# EAGLE design Arduino Nano RGB Led Controller (EAGLE 7.6.0)
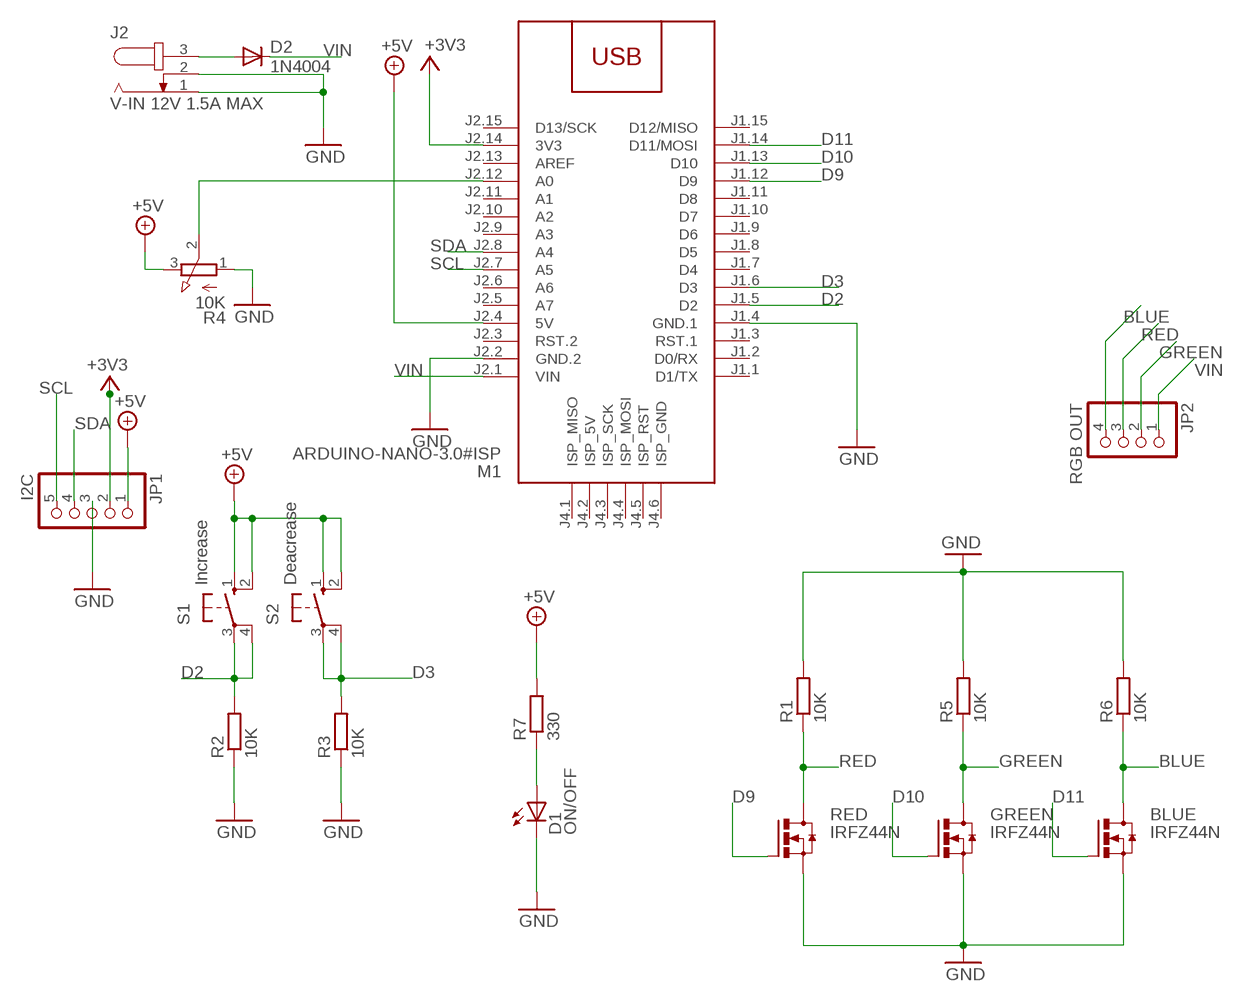
[diagram p0: schematic, sheet 1]

## Parts
BLUE  IRFZ44N  [TO220V]
D1  ON/OFF  LEDCHIPLED_1206  [CHIPLED_1206]
D2  1N4004  [DO41-10]
GREEN  IRFZ44N  [TO220V]
J2  V-IN 12V 1.5A MAX  JACK-PLUG1  [SPC4078]
JP1  I2C  PINHD-1X55X2MM  [1_05X2MM]
JP2  RGB OUT  PINHD-1X4  [1X04]
M1  ARDUINO-NANO-3.0#ISP  [ARDUINO-NANO-3.0#ISP]
R1  10K  R-EU_M1206  [M1206]
R2  10K  R-EU_M1206  [M1206]
R3  10K  R-EU_M1206  [M1206]
R4  10K  3RP/1610N  [3RP/1610N]
R5  10K  R-EU_M1206  [M1206]
R6  10K  R-EU_M1206  [M1206]
R7  330  R-EU_M1206  [M1206]
RED  IRFZ44N  [TO220V]
S1  Increase  10-XX  [B3F-10XX]
S2  Deacrease  10-XX  [B3F-10XX]

## Nets
+3V3: JP1.2 M1.J2.14(3V3)
+5V: JP1.1 M1.J2.4(5V) R4.3(E) R7.2 S1.1(S) S1.2(S1) S2.1(S) S2.2(S1)
BLUE [vin]: BLUE.2(D) JP2.4 R6.1
D2: M1.J1.5(D2) R2.2 S1.3(P) S1.4(P1)
D3: M1.J1.6(D3) R3.2 S2.3(P) S2.4(P1)
D9: M1.J1.12(D9) RED.1(G)
D10: GREEN.1(G) M1.J1.13(D10)
D11: BLUE.1(G) M1.J1.14(D11/MOSI)
GND: BLUE.3(S) D1.C GREEN.3(S) J2.1 J2.2 JP1.3 M1.J1.4(GND.1) M1.J2.2(GND.2) R1.2 R2.1 R3.1 R4.1(A) R5.2 R6.2 RED.3(S)
GREEN [vin]: GREEN.2(D) JP2.2 R5.1
N$1: M1.J2.12(A0) R4.2(S)
N$2: D1.A R7.1
N$3 [vin]: D2.A J2.3
RED [vin]: JP2.3 R1.1 RED.2(D)
SCL: JP1.5 M1.J2.7(A5)
SDA: JP1.4 M1.J2.8(A4)
VIN [vin]: D2.C JP2.1 M1.J2.1(VIN)
Unconnected: M1.J1.1(D1/TX) M1.J1.2(D0/RX) M1.J1.3(RST.1) M1.J1.7(D4) M1.J1.8(D5) M1.J1.9(D6) M1.J1.10(D7) M1.J1.11(D8) M1.J1.15(D12/MISO) M1.J2.3(RST.2) M1.J2.5(A7) M1.J2.6(A6) M1.J2.9(A3) M1.J2.10(A2) M1.J2.11(A1) M1.J2.13(AREF) M1.J2.15(D13/SCK) M1.J4.1(ISP_MISO) M1.J4.2(ISP_5V) M1.J4.3(ISP_SCK) M1.J4.4(ISP_MOSI) M1.J4.5(ISP_RST) M1.J4.6(ISP_GND)

## Library data of the parts
BLUE GREEN RED = MySemicontuctors:IRFZ44N
D1 = adafruit:LED: LED OSRAM: - CHIPLED LG R971, LG N971, LY N971, LG Q971, LY Q971, LO R971, LY R971 LH N974, LH R974 LS Q976, LO Q976, LY Q976 LO Q996 - Hyper CHIPLED LW Q18S LB Q993, LB Q99A, LB R99A - SideLED LS A670, LO A670, LY A670, LG A670, LP A670 LB A673, LV A673, LT A673, LW A673 LH A674 LY A675 LS A676, LA A676, LO A676, LY A676, LW A676 LS A679, LY A679, LG A679 - Hyper Micro SIDELED® LS Y876, LA Y876, LO Y876, LY Y876 LT Y87S - SmartLED LW L88C, LW L88S LB L89C, LB L89S, LG L890 LS L89K, LO L89K, LY L89K LS L896, LA L896, LO L896, LY L896 - TOPLED LS T670, LO T670, LY T670, LG T670, LP T670 LSG T670, LSP T670, LSY T670, LOP T670, LYG T670 LG T671, LOG T671, LSG T671 LB T673, LV T673, LT T673, LW T673 LH T674 LS T676, LA T676, LO T676, LY T676, LB T676, LH T676, LSB T676, LW T676 LB T67C, LV T67C, LT T67C, LS T67K, LO T67K, LY T67K, LW E67C LS E67B, LA E67B, LO E67B, LY E67B, LB E67C, LV E67C, LT E67C LW T67C LS T679, LY T679, LG T679 LS T770, LO T770, LY T770, LG T770, LP T770 LB T773, LV T773, LT T773, LW T773 LH T774 LS E675, LA E675, LY E675, LS T675 LS T776, LA T776, LO T776, LY T776, LB T776 LHGB T686 LT T68C, LB T68C - Hyper Mini TOPLED® LB M676 - Mini TOPLED Santana® LG M470 LS M47K, LO M47K, LY M47K Source: http://www.osram.convergy.de/
D2 = diode:1N4004: DIODE general purpose rectifier, 1 A
J2 = con-jack:JACK-PLUG: DC POWER JACK Power Jack, DC, Right Angle, Through Hole, Rated 5A at 16VDC, PC Terminals Distributor: Farnell (www.Farnell.de) Drawing: 84N1161.pdf / 84N1162.pdf Manufacturer: SPC Technology (www.spctechnology.com) Type: SPC4077 / SPC 4078; OC_FARNELL: unknown; OC_NEWARK: unknown
JP1 = pinhead:PINHD-1X5: PIN HEADER
JP2 = pinhead:PINHD-1X4: PIN HEADER
M1 = diy-modules:ARDUINO-NANO-3.0#ISP: Arduino Nano 3.0 with ISP pads
R1-R3 R5-R7 = rcl:R-EU_: RESISTOR, European symbol
R4 = pot:3RP/1610N: 16mm Potentiometer one level Source: http://www.alphapotentiometers.net/html/16mm_pot_2.html
S1 S2 = switch-omron:10-XX: OMRON SWITCH; MPN: B3F-1000; OC_FARNELL: 176432; OC_NEWARK: 36M3542

## Net classes
1 vin: width 0.762 mm, clearance 0.203 mm

## Board
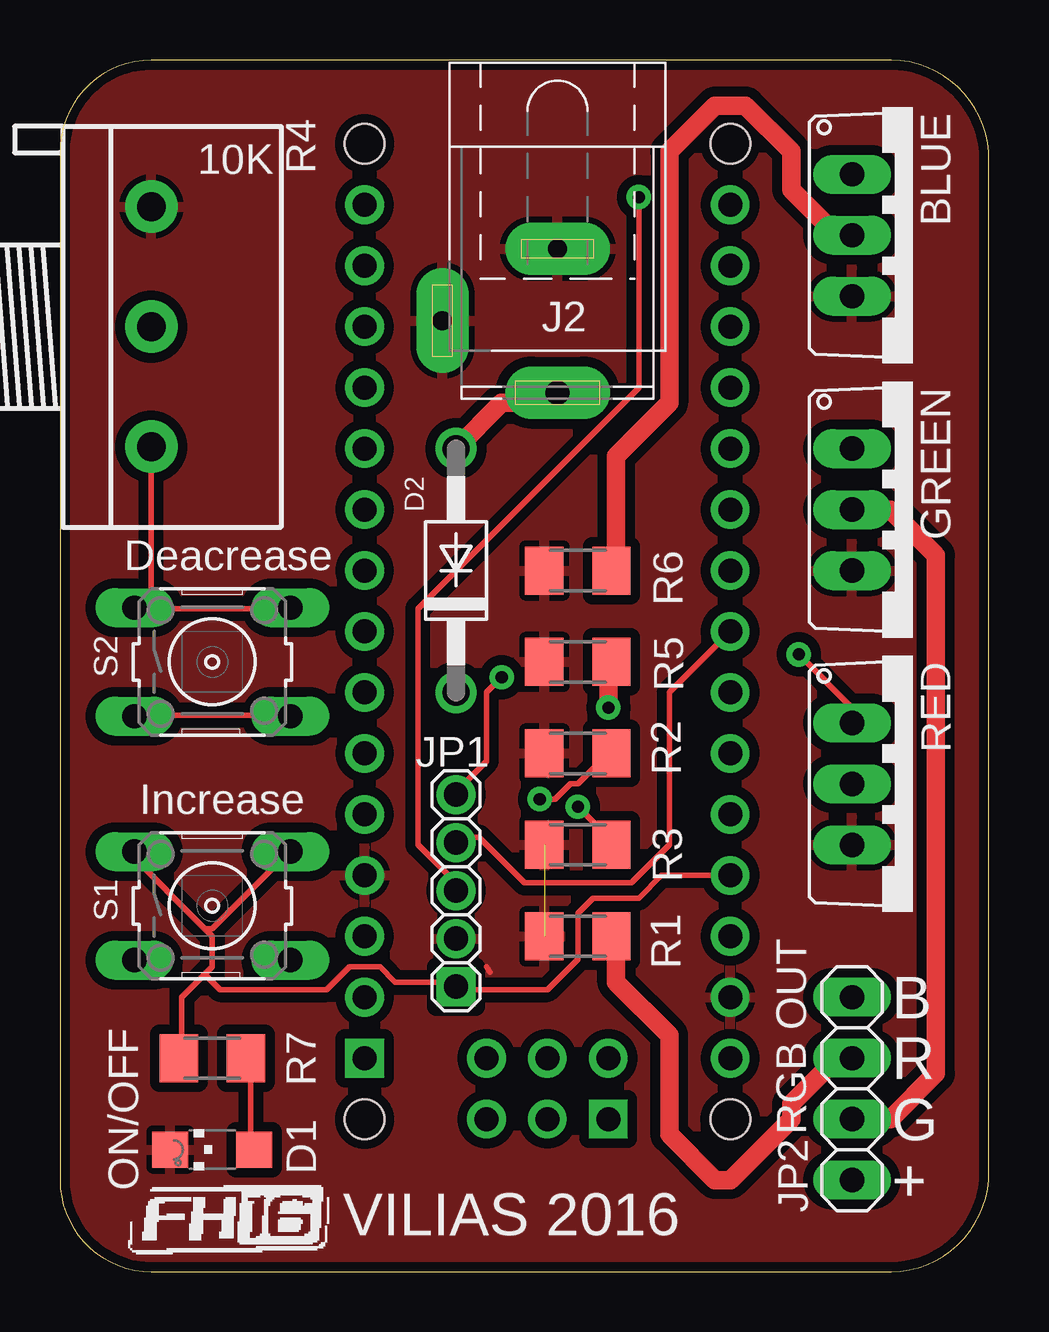
[diagram p1: board, top side]
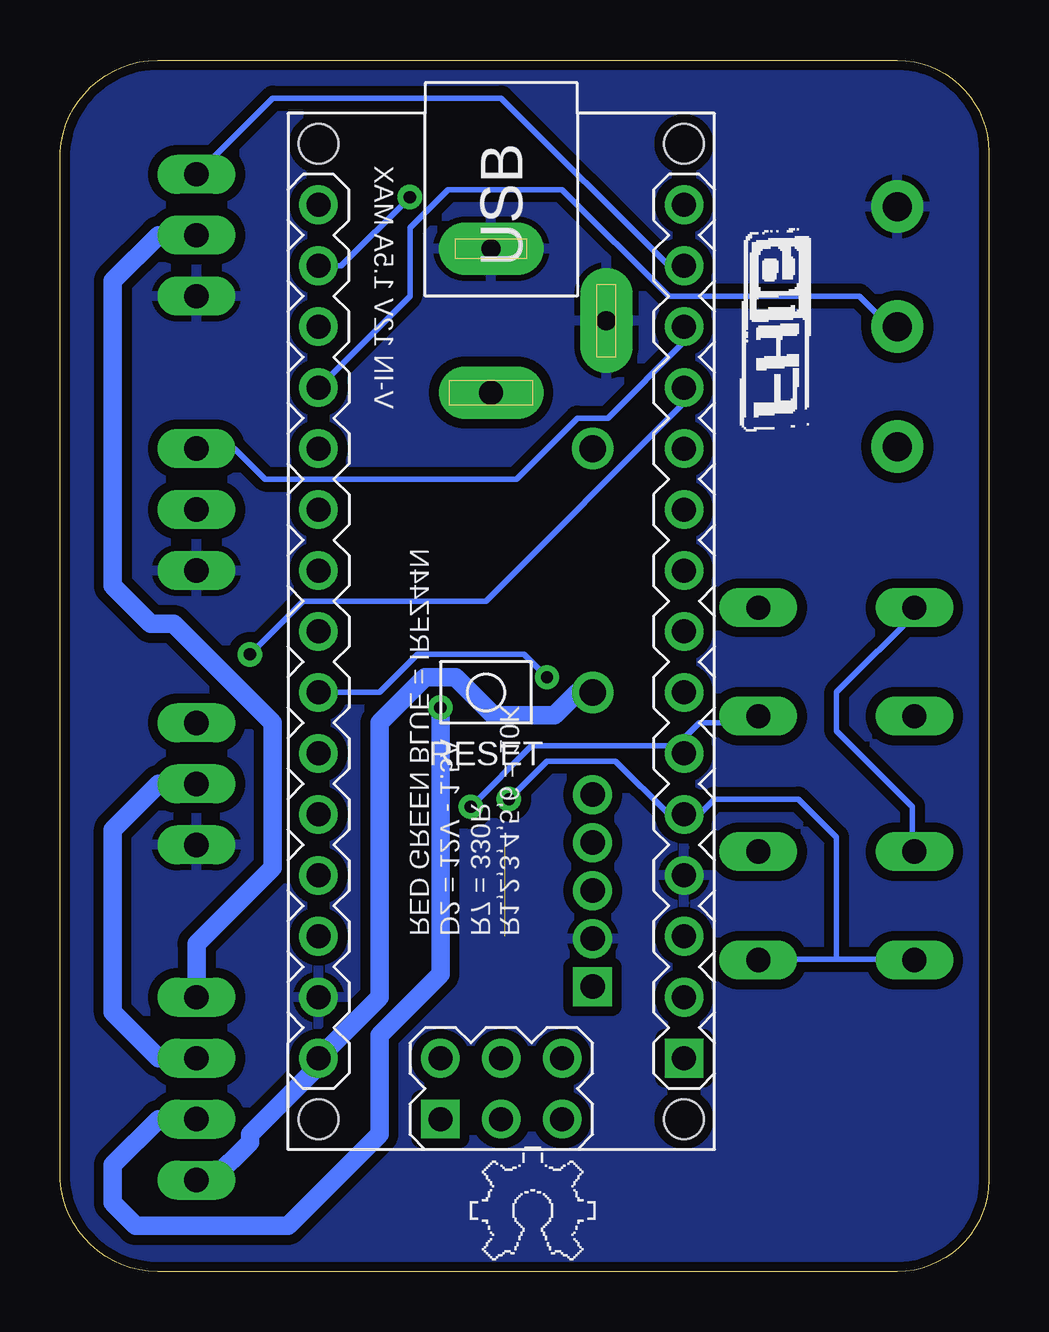
[diagram p2: board, bottom side, seen from below]

Size 38.72 x 50.49 mm. Coordinates in mm from the lower left corner, seen from the top.
Outline: 0,46.67 0,3.82 arc90 3.81,0.01 34.27,0.01 arc90 38.72,3.82 38.72,46.67 arc90 34.27,50.48 3.81,50.48 arc90 0,46.67
Copper layers (1*16): Top 0.035mm / dielectric 1.5mm / Bottom 0.035mm
Design rules "vilias_clearance10mil": minimum track width 8mil, minimum drill 20mil, track to track 10mil, track to pad 10mil, pad to pad 10mil, via to via 10mil, smd to smd 10mil, copper to edge 10mil, drill to drill 8mil, minimum pad ring 12mil, minimum via ring 10mil, stop-mask expansion 4mil, vias tented up to drill 25mil, thermal gap 10mil

### Footprints (pad centres in the part's own frame; a part is rotated, then mirrored left to right if it is on the bottom)
TO220V = drill 1.016 long: 1 -2.54,0; 2 0,0; 3 2.54,0
CHIPLED_1206 = smd 1.5 x 1.5: A 0,-1.75; C 0,1.75
DO41-10 = drill 1.118: A 5.08,0; C -5.08,0
SPC4078 = drill 0.8 pad 2.184 long: 1 -3,0; 2 0,-4.8 | drill 1 pad 2.184 long: 3 3,0
1_05X2MM = drill 1.016 pad 1.3 square: 1 -4,0 | drill 1.016 pad 1.3: 2 0,0; 3 -2,0; 4 2,0; 5 4,0
1X04 = drill 1.016 long: 1 -3.81,0; 2 -1.27,0; 3 1.27,0; 4 3.81,0
ARDUINO-NANO-3.0#ISP = drill 1 square: J1.1 17.78,7.62; J4.1 20.32,-2.54 | drill 1: J1.2 15.24,7.62; J1.3 12.7,7.62; J1.4 10.16,7.62; J1.5 7.62,7.62; J1.6 5.08,7.62; J1.7 2.54,7.62; J1.8 0,7.62; J1.9 -2.54,7.62; J1.10 -5.08,7.62; J1.11 -7.62,7.62; J1.12 -10.16,7.62; J1.13 -12.7,7.62; J1.14 -15.24,7.62; J1.15 -17.78,7.62; J2.1 17.78,-7.62; J2.2 15.24,-7.62; J2.3 12.7,-7.62; J2.4 10.16,-7.62; J2.5 7.62,-7.62; J2.6 5.08,-7.62; J2.7 2.54,-7.62; J2.8 0,-7.62; J2.9 -2.54,-7.62; J2.10 -5.08,-7.62; J2.11 -7.62,-7.62; J2.12 -10.16,-7.62; J2.13 -12.7,-7.62; J2.14 -15.24,-7.62; J2.15 -17.78,-7.62; J4.2 17.78,-2.54; J4.3 20.32,0; J4.4 17.78,0; J4.5 20.32,2.54; J4.6 17.78,2.54 | hole 1.651: -20.32,7.62; -20.32,-7.62; 20.32,-7.62; 20.32,7.62
M1206 = smd 1.6 x 2: 1 -1.4,0; 2 1.4,0
3RP/1610N = drill 1.2 pad 2.184: 1 -5,0; 2 0,0; 3 5,0
B3F-10XX = drill 1.016 long: 1 -3.251,2.261; 2 3.251,2.261; 3 -3.251,-2.261; 4 3.251,-2.261

### Placement (x,y rotation side)
BLUE  33.02,43.19 270 top
D1  6.35,5.09 90 top
D2  16.51,29.22 90 top
GREEN  33.02,31.76 270 top
J2  20.74,39.63 270 top
JP1  16.51,15.89 90 top
JP2  33.02,7.63 90 top
M1  20.32,26.68 270 bottom
R1  21.59,13.98 180 top
R2  21.59,21.6 0 top
R3  21.59,17.79 0 top
R4  3.81,39.38 270 top
R5  21.59,25.41 180 top
R6  21.59,29.22 180 top
R7  6.35,8.9 180 top
RED  33.02,20.33 270 top
S1  6.35,15.25 0 top
S2  6.35,25.41 0 top

### Tracks (layer width: path | path; a pad name or v marks a point on that pad's centre or on a via)
+3V3  (via drill 0.51)
  Top 0.229: v24.13,44.78 24.13,36.84 14.92,27.63 14.92,17.79 16.51,16.2 JP1.2
  Bottom 0.229: M1.J2.14 26.99,41.92 v24.13,44.78
+5V
  Top 0.229: M1.J2.4 25.08,16.52 24.13,15.57 22.23,15.57 21.59,14.93 21.59,13.03 20.32,11.76 16.51,11.76 JP1.1 16.51,12.08 13.97,12.08 13.34,12.71 12.06,12.71 11.11,11.76 6.67,11.76 6.03,12.39 | 6.03,12.39 6.35,12.71 6.35,13.98 6.03,14.3 | 6.03,12.39 5.08,11.44 5.08,8.9 R7.2 | 6.03,14.3 2.86,17.47 S1.1 | 6.03,14.3 6.35,14.3 9.53,17.47 S1.2 | 3.81,27.63 9.53,27.63 S2.2 | 3.81,27.63 3.17,27.63 S2.1 3.81,27.63 | 3.81,27.63 R4.3
  Bottom 0.229: S1.1 3.17,17.79 3.17,19.38 6.35,22.55 6.35,24.14 2.86,27.63 S2.1
BLUE
  Top 0.762: BLUE.2 32.38,43.19 30.48,45.1 30.48,46.68 28.57,48.59 27.3,48.59 25.4,46.68 25.4,36.21 23.18,33.98 23.18,29.22 R6.1
  Bottom 0.762: JP2.4 33.02,13.66 29.84,16.84 29.84,22.87 33.97,27 34.92,27 36.51,28.59 36.51,41.29 34.61,43.19 BLUE.2
D2  (via drill 0.51)
  Top 0.229: v20,19.7 20.64,19.7 21.27,20.33 21.59,20.33 22.86,21.6 R2.2
  Bottom 0.229: 6.35,13.03 9.53,13.03 S1.4 | 6.35,13.03 3.17,13.03 S1.3 | v20,19.7 18.41,21.28 15.56,21.28 13.34,19.06 M1.J1.5 12.06,19.06 11.43,19.7 7.94,19.7 6.35,18.11 6.35,13.03
D3  (via drill 0.51)
  Top 0.229: S2.3 3.17,23.19 9.53,23.19 S2.4 | v21.59,19.38 22.86,18.11 22.86,17.79 R3.2
  Bottom 0.229: v21.59,19.38 19.05,21.92 13.02,21.92 | 13.02,21.92 12.06,22.87 9.84,22.87 S2.4 | 13.02,21.92 M1.J1.6
D9  (via drill 0.51)
  Top 0.229: v30.8,25.73 33.02,23.51 RED.1
  Bottom 0.229: M1.J1.12 12.7,36.21 20.95,27.95 28.57,27.95 v30.8,25.73
D10
  Bottom 0.229: M1.J1.13 12.7,38.75 15.88,35.57 17.14,35.57 19.68,33.03 30.16,33.03 31.43,34.3 GREEN.1
D11
  Bottom 0.229: M1.J1.14 13.34,41.92 20.32,48.91 29.84,48.91 BLUE.1
GND  (1 unrouted)
  Top 0.229: 17.78,12.71 17.93,12.48
  pour Top (isolate 0.406): 1.27,50.81 34.29,50.81 arc-90 39.37,45.73 39.37,3.82 arc-90 35.56,0.01 3.81,0.01 arc-90 0,3.82 0,49.54 arc-90
  pour Bottom (isolate 0.406): 1.27,50.81 34.29,50.81 arc-90 39.37,45.73 39.37,5.09 arc-90 34.29,0.01 3.81,0.01 arc-90 0,3.82 0,49.54 arc-90
GREEN  (via drill 0.51)
  Top 0.762: v22.86,23.51 22.86,25.41 R5.1 | GREEN.2 34.61,31.76 36.51,29.86 36.51,8.27 34.61,6.36 JP2.2
  Bottom 0.762: v22.86,23.51 22.86,12.39 25.4,9.85 25.4,5.73 29.21,1.92 35.56,1.92 36.51,2.87 36.51,4.46 34.61,6.36 JP2.2
N$1
  Bottom 0.229: M1.J2.12 24.13,40.65 24.13,43.51 22.54,45.1 17.78,45.1 13.34,40.65 5.4,40.65 4.13,39.38 R4.2
N$2
  Top 0.229: D1.A 7.94,5.09 7.94,8.9 R7.1
N$3
  Top 0.762: D2.A 18.41,36.21 20.32,36.21 J2.3
RED
  Top 0.762: JP2.3 32.38,8.9 30.48,7 30.48,6.36 27.94,3.82 27.3,3.82 25.4,5.73 25.4,9.85 23.18,12.08 23.18,13.98 R1.1
  Bottom 0.762: RED.2 34.61,20.33 36.51,18.43 36.51,10.81 34.61,8.9 JP2.3
SCL  (via drill 0.51)
  Top 0.229: v18.41,24.78 17.78,24.14 17.78,21.28 16.51,20.01 JP1.5
  Bottom 0.229: M1.J2.7 25.4,24.14 23.81,25.73 19.37,25.73 v18.41,24.78
SDA
  Top 0.229: M1.J2.8 25.4,24.14 25.4,17.79 23.81,16.2 19.37,16.2 17.46,18.11 16.51,18.11 JP1.4
VIN
  Bottom 0.762: JP2.1 32.38,3.82 30.8,5.41 30.8,5.73 27.94,8.58 M1.J2.1 25.4,11.44 25.4,22.87 23.5,24.78 22.23,24.78 20.64,23.19 18.1,23.19 17.14,24.14 D2.C

### Text on the board
tPlace: VILIAS 2016
tNames: B | R | G | +
bNames: R1,2,3,4,5,6 = 10K / R7 = 330R | D2 = 12V - 1.5A | RED GREEN BLUE = IRFZ44N